# Altium schematic sheet POWER.SchDoc (part 2 of 2)
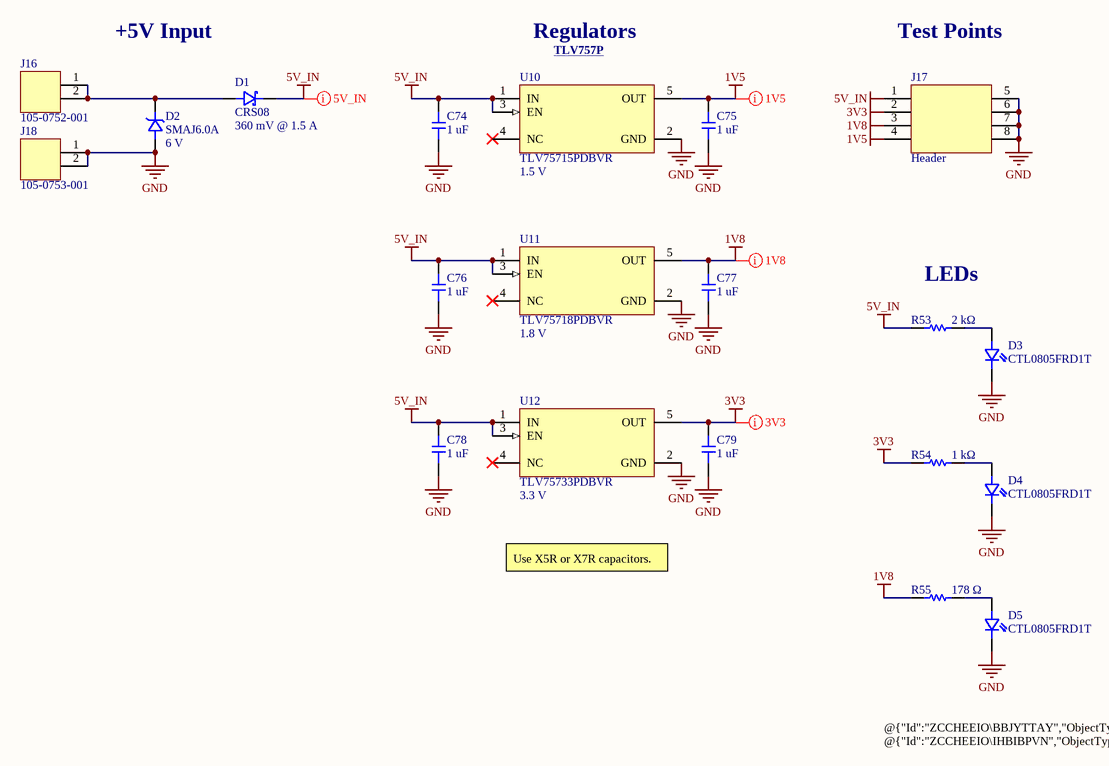
[diagram p1: POWER.SchDoc]

## Library data of the parts (continued)
U11 = TLV75718PDBVR: 1-A, low-IQ high-accuracy low-dropout (LDO) voltage regulator with enable 5-SOT-23 -40 to 125; Manufacturer: Texas Instruments; Manufacturer Lifecycle Status: ACTIVE; Output Current: 1 A; Accuracy: 1%; Dropout Voltage: 650mV; Max Junction Temperature (Tj): 125°C; Max Supply Voltage: 5.5V; Min Supply Voltage: 1.45V; Nominal Supply Current: 25µA; Number of Channels: 1; Manufacturer Part Number: TLV75718PDBVR; Supplier: DigiKey; Supplier Part Number: 296-50413-1-ND; RoHS: Compliant; Category: LDO Voltage Regulators; Stock: 12647; Pricing: 1=0.33, 10=0.229, 25=0.2032, 100=0.1751, 250=0.16168, 500=0.15358, 1000=0.14692 (USD); Case/Package: SOT-23; Height: 1.45mm; Length: 2.9mm; Lifecycle Status: Production; Max Operating Temperature: 125°C; Min Operating Temperature: -40°C; Number of Outputs: 1; Pins: 5; Schedule B: 8542390000, 8542390000|8542390000|8542390000|8542390000|8542390000; Thickness: 1.2mm; Width: 1.6mm; ComponentLink1URL: https://sigma.octopart.com:443/177332311/technical_drawing/Texas-Instruments-TLV75718PDBVR.pdf?src-supplier=Texas+Instruments; ComponentLink1Description: https://sigma.octopart.com:443/177332311/technical_drawing/Texas-Instruments-TLV75718PDBVR.pdf?src-supplier=Texas+Instruments; ComponentLink2URL: https://octopart.com:443/opatz8j6/c1?t=LNhw8VYZlWpvSgfwSbWwER0C1aFrb4WiDbvbIAGvhxvgQJSu-YTHIYusHOkqrFl1ubYiC7hECb41naNFPdUxKtCiz9_QYZXvTPuT2kWWY7P1iaj_9VuZ0VXU-pOF7midcWATfFw5vckxfwAqZx9Q2ej4q7wKDFH9Xtp9E58D2pRmx7nz-A2MSPhDRcBhv6VVNe5pwxWdv5qqQWIE0Ip5EXAq_TZ793t-Km77zPzDy5oRrzSJqtrEGO8Rg9L3KNyczjw3CqQXp4IaldJF9NwqSrhLVRVV24aJWYeWxK7QEZ1zbLdzfLHpUNGWUx5BArHk98TBn7whuhePb0udLY4hessARU-N37P82AGNs8v-R6eVBy-k_l2R0DXlJserTyRNxdjxCkw&src-supplier=Texas+Instruments; ComponentLink2Description: https://octopart.com:443/opatz8j6/c1?t=LNhw8VYZlWpvSgfwSbWwER0C1aFrb4WiDbvbIAGvhxvgQJSu-YTHIYusHOkqrFl1ubYiC7hECb41naNFPdUxKtCiz9_QYZXvTPuT2kWWY7P1iaj_9VuZ0VXU-pOF7midcWATfFw5vckxfwAqZx9Q2ej4q7wKDFH9Xtp9E58D2pRmx7nz-A2MSPhDRcBhv6VVNe5pwxWdv5qqQWIE0Ip5EXAq_TZ793t-Km77zPzDy5oRrzSJqtrEGO8Rg9L3KNyczjw3CqQXp4IaldJF9NwqSrhLVRVV24aJWYeWxK7QEZ1zbLdzfLHpUNGWUx5BArHk98TBn7whuhePb0udLY4hessARU-N37P82AGNs8v-R6eVBy-k_l2R0DXlJserTyRNxdjxCkw&src-supplier=Texas+Instruments; ComponentLink3URL: https://sigma.octopart.com:443/175570406/technical_drawing/Texas-Instruments-TLV75718PDBVR.pdf?src-supplier=Texas+Instruments; ComponentLink3Description: https://sigma.octopart.com:443/175570406/technical_drawing/Texas-Instruments-TLV75718PDBVR.pdf?src-supplier=Texas+Instruments; ComponentLink4URL: https://sigma.octopart.com:443/169406034/technical_drawing/Texas-Instruments-TLV75718PDBVR.pdf?src-supplier=Texas+Instruments; ComponentLink4Description: https://sigma.octopart.com:443/169406034/technical_drawing/Texas-Instruments-TLV75718PDBVR.pdf?src-supplier=Texas+Instruments; ComponentLink5URL: https://sigma.octopart.com:443/155939316/technical_drawing/Texas-Instruments-TLV75718PDBVR.pdf?src-supplier=Texas+Instruments; ComponentLink5Description: https://sigma.octopart.com:443/155939316/technical_drawing/Texas-Instruments-TLV75718PDBVR.pdf?src-supplier=Texas+Instruments; ComponentLink6URL: https://sigma.octopart.com:443/102331370/technical_drawing/Texas-Instruments-TLV75718PDBVR.pdf?src-supplier=Texas+Instruments; ComponentLink6Description: https://sigma.octopart.com:443/102331370/technical_drawing/Texas-Instruments-TLV75718PDBVR.pdf?src-supplier=Texas+Instruments; ComponentLink7URL: https://datasheet.octopart.com:443/TLV75718PDBVR-Texas-Instruments-datasheet-151190461.pdf?src-supplier=Upverter; ComponentLink7Description: https://datasheet.octopart.com:443/TLV75718PDBVR-Texas-Instruments-datasheet-151190461.pdf?src-supplier=Upverter; ComponentLink8URL: https://datasheet.octopart.com:443/TLV75718PDBVR-Texas-Instruments-datasheet-164419132.pdf?src-supplier=Augswan; ComponentLink8Description: https://datasheet.octopart.com:443/TLV75718PDBVR-Texas-Instruments-datasheet-164419132.pdf?src-supplier=Augswan; ComponentLink9URL: https://datasheet.octopart.com:443/TLV75718PDBVR-Texas-Instruments-datasheet-165804641.pdf?src-supplier=LCSC; ComponentLink9Description: https://datasheet.octopart.com:443/TLV75718PDBVR-Texas-Instruments-datasheet-165804641.pdf?src-supplier=LCSC; ComponentLink10URL: https://datasheet.octopart.com:443/TLV75718PDBVR-Texas-Instruments-datasheet-159117837.pdf?src-supplier=LCSC; ComponentLink10Description: https://datasheet.octopart.com:443/TLV75718PDBVR-Texas-Instruments-datasheet-159117837.pdf?src-supplier=LCSC; ComponentLink11URL: http://sigma.octopart.com:80/reach_statement/Texas-Instruments-company-64.pdf?src-supplier=Compliance+Statements; ComponentLink11Description: http://sigma.octopart.com:80/reach_statement/Texas-Instruments-company-64.pdf?src-supplier=Compliance+Statements; ComponentLink12URL: http://sigma.octopart.com:80/conflict_mineral_statement/Texas-Instruments-company-63.pdf?src-supplier=Compliance+Statements; ComponentLink12Description: http://sigma.octopart.com:80/conflict_mineral_statement/Texas-Instruments-company-63.pdf?src-supplier=Compliance+Statements
U12 = TLV75733PDBVR: 1-A, low-IQ high-accuracy low-dropout (LDO) voltage regulator with enable 5-SOT-23 -40 to 125; Manufacturer: Texas Instruments; Manufacturer Lifecycle Status: ACTIVE; Output Current: 1 A; Accuracy: 1%; Dropout Voltage: 1.35V; Max Junction Temperature (Tj): 125°C; Max Supply Voltage: 5.5V; Min Supply Voltage: 1.45V; Number of Channels: 1; Manufacturer Part Number: TLV75733PDBVR; Supplier: DigiKey; Supplier Part Number: 296-50414-1-ND; RoHS: Compliant; Category: LDO Voltage Regulators; Stock: 9339; Pricing: 1=0.33, 10=0.229, 25=0.2032, 100=0.1751, 250=0.16168, 500=0.15358, 1000=0.14692 (USD); Case/Package: SOT-23; Height: 1.45mm; Length: 2.9mm; Lifecycle Status: Production; Max Operating Temperature: 125°C; Min Operating Temperature: -40°C; Number of Outputs: 1; Pins: 5; Schedule B: 8542390000, 8542390000|8542390000|8542390000|8542390000|8542390000; Thickness: 1.2mm; Width: 1.6mm; ComponentLink1URL: https://sigma.octopart.com:443/177332311/technical_drawing/Texas-Instruments-TLV75733PDBVR.pdf?src-supplier=Texas+Instruments; ComponentLink1Description: https://sigma.octopart.com:443/177332311/technical_drawing/Texas-Instruments-TLV75733PDBVR.pdf?src-supplier=Texas+Instruments; ComponentLink2URL: https://octopart.com:443/opatz8j6/c1?t=o_IEZOOxq13ZapM8h6eyVu6U4w7uJ0lOpdn1eQGus_LxPlF5140NiI_IzcwdUYrJ31K3ZwQ0inlTMb17Fre9UGVV-cyueG3giZtsqNdfBTaDvWHPrUnuYqbjGGi1Ds2698qqLwV3Tlrub6HkjX8UNxdzrCQv7HZbxbhh4yUVoxpAQ1qsH8ZXaPiP3z0geKqV9LoOfem8uzwcPRQneIzB8HlYy48TGA3XJ2QdRU4asiXFDExmiO-kVw1cCOAyjCAZDaRc6pkHeHkCvnc9-OsSmWRnTJK9cYXxUvWANDQacA2frlSUhGVJAUMlyqJStMqs6xJQSWGFCunWce9bwDnK-mHRtMdijleQcFxXiu3YZMz3tjqIGqvB3GT98ijRk5E9binYeYc&src-supplier=Texas+Instruments; ComponentLink2Description: https://octopart.com:443/opatz8j6/c1?t=o_IEZOOxq13ZapM8h6eyVu6U4w7uJ0lOpdn1eQGus_LxPlF5140NiI_IzcwdUYrJ31K3ZwQ0inlTMb17Fre9UGVV-cyueG3giZtsqNdfBTaDvWHPrUnuYqbjGGi1Ds2698qqLwV3Tlrub6HkjX8UNxdzrCQv7HZbxbhh4yUVoxpAQ1qsH8ZXaPiP3z0geKqV9LoOfem8uzwcPRQneIzB8HlYy48TGA3XJ2QdRU4asiXFDExmiO-kVw1cCOAyjCAZDaRc6pkHeHkCvnc9-OsSmWRnTJK9cYXxUvWANDQacA2frlSUhGVJAUMlyqJStMqs6xJQSWGFCunWce9bwDnK-mHRtMdijleQcFxXiu3YZMz3tjqIGqvB3GT98ijRk5E9binYeYc&src-supplier=Texas+Instruments; ComponentLink3URL: https://sigma.octopart.com:443/175570406/technical_drawing/Texas-Instruments-TLV75733PDBVR.pdf?src-supplier=Texas+Instruments; ComponentLink3Description: https://sigma.octopart.com:443/175570406/technical_drawing/Texas-Instruments-TLV75733PDBVR.pdf?src-supplier=Texas+Instruments; ComponentLink4URL: https://sigma.octopart.com:443/169406034/technical_drawing/Texas-Instruments-TLV75733PDBVR.pdf?src-supplier=Texas+Instruments; ComponentLink4Description: https://sigma.octopart.com:443/169406034/technical_drawing/Texas-Instruments-TLV75733PDBVR.pdf?src-supplier=Texas+Instruments; ComponentLink5URL: https://sigma.octopart.com:443/155939316/technical_drawing/Texas-Instruments-TLV75733PDBVR.pdf?src-supplier=Texas+Instruments; ComponentLink5Description: https://sigma.octopart.com:443/155939316/technical_drawing/Texas-Instruments-TLV75733PDBVR.pdf?src-supplier=Texas+Instruments; ComponentLink6URL: https://sigma.octopart.com:443/102331370/technical_drawing/Texas-Instruments-TLV75733PDBVR.pdf?src-supplier=Texas+Instruments; ComponentLink6Description: https://sigma.octopart.com:443/102331370/technical_drawing/Texas-Instruments-TLV75733PDBVR.pdf?src-supplier=Texas+Instruments; ComponentLink7URL: https://datasheet.octopart.com:443/TLV75733PDBVR-Texas-Instruments-datasheet-164419132.pdf?src-supplier=Augswan; ComponentLink7Description: https://datasheet.octopart.com:443/TLV75733PDBVR-Texas-Instruments-datasheet-164419132.pdf?src-supplier=Augswan; ComponentLink8URL: https://datasheet.octopart.com:443/TLV75733PDBVR-Texas-Instruments-datasheet-165804641.pdf?src-supplier=LCSC; ComponentLink8Description: https://datasheet.octopart.com:443/TLV75733PDBVR-Texas-Instruments-datasheet-165804641.pdf?src-supplier=LCSC; ComponentLink9URL: https://datasheet.octopart.com:443/TLV75733PDBVR-Texas-Instruments-datasheet-159117837.pdf?src-supplier=LCSC; ComponentLink9Description: https://datasheet.octopart.com:443/TLV75733PDBVR-Texas-Instruments-datasheet-159117837.pdf?src-supplier=LCSC; ComponentLink10URL: http://sigma.octopart.com:80/reach_statement/Texas-Instruments-company-64.pdf?src-supplier=Compliance+Statements; ComponentLink10Description: http://sigma.octopart.com:80/reach_statement/Texas-Instruments-company-64.pdf?src-supplier=Compliance+Statements; ComponentLink11URL: http://sigma.octopart.com:80/conflict_mineral_statement/Texas-Instruments-company-63.pdf?src-supplier=Compliance+Statements; ComponentLink11Description: http://sigma.octopart.com:80/conflict_mineral_statement/Texas-Instruments-company-63.pdf?src-supplier=Compliance+Statements